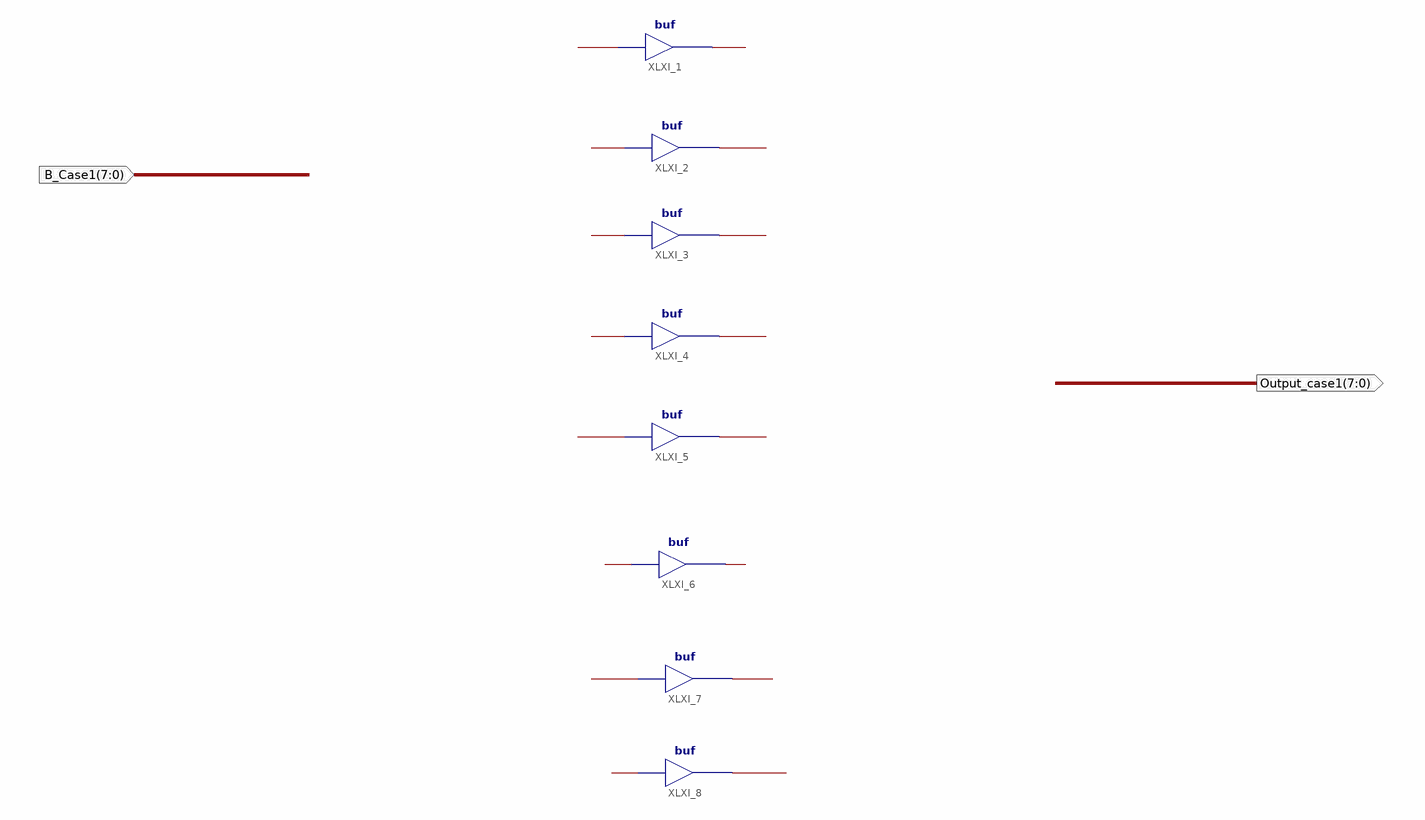
[diagram p0: schematic sheet 1]
// Xilinx ISE schematic B_Output.sch (spartan6) as structural Verilog: 8 symbols, 2 ports
module B_Output (
  input  [7:0] B_Case1,
  output [7:0] Output_case1
);

  buf XLXI_1 (Output_case1[0], B_Case1[0]);
  buf XLXI_2 (Output_case1[1], B_Case1[1]);
  buf XLXI_3 (Output_case1[2], B_Case1[2]);
  buf XLXI_4 (Output_case1[3], B_Case1[3]);
  buf XLXI_5 (Output_case1[4], B_Case1[4]);
  buf XLXI_6 (Output_case1[5], B_Case1[5]);
  buf XLXI_7 (Output_case1[6], B_Case1[6]);
  buf XLXI_8 (Output_case1[7], B_Case1[7]);
endmodule
